# Altium project ELC0102 - Scoreboard.PrjPcb (part 2 of 2)

## Sheet ELC0102 - ScoreBoard - TopLevel.SchDoc: ELC102 - NEOS Scoreboard
size C; PageSetup: Record=PageOptions|CenterHorizontal=True|CenterVertical=True|PrintScale=0.33|XCorrection=1.00|YCorrection=1.00|PrintKind=0|BorderSize=5000000|LeftOffset=0|BottomOffset=0|Orientation=2|PaperLength=1000|PaperWidth=1000|Scale=100|PaperSource=15|PrintQuality=1200|MediaType=1|DitherType=10|PaperKind=11x17|PrintScaleMode=1
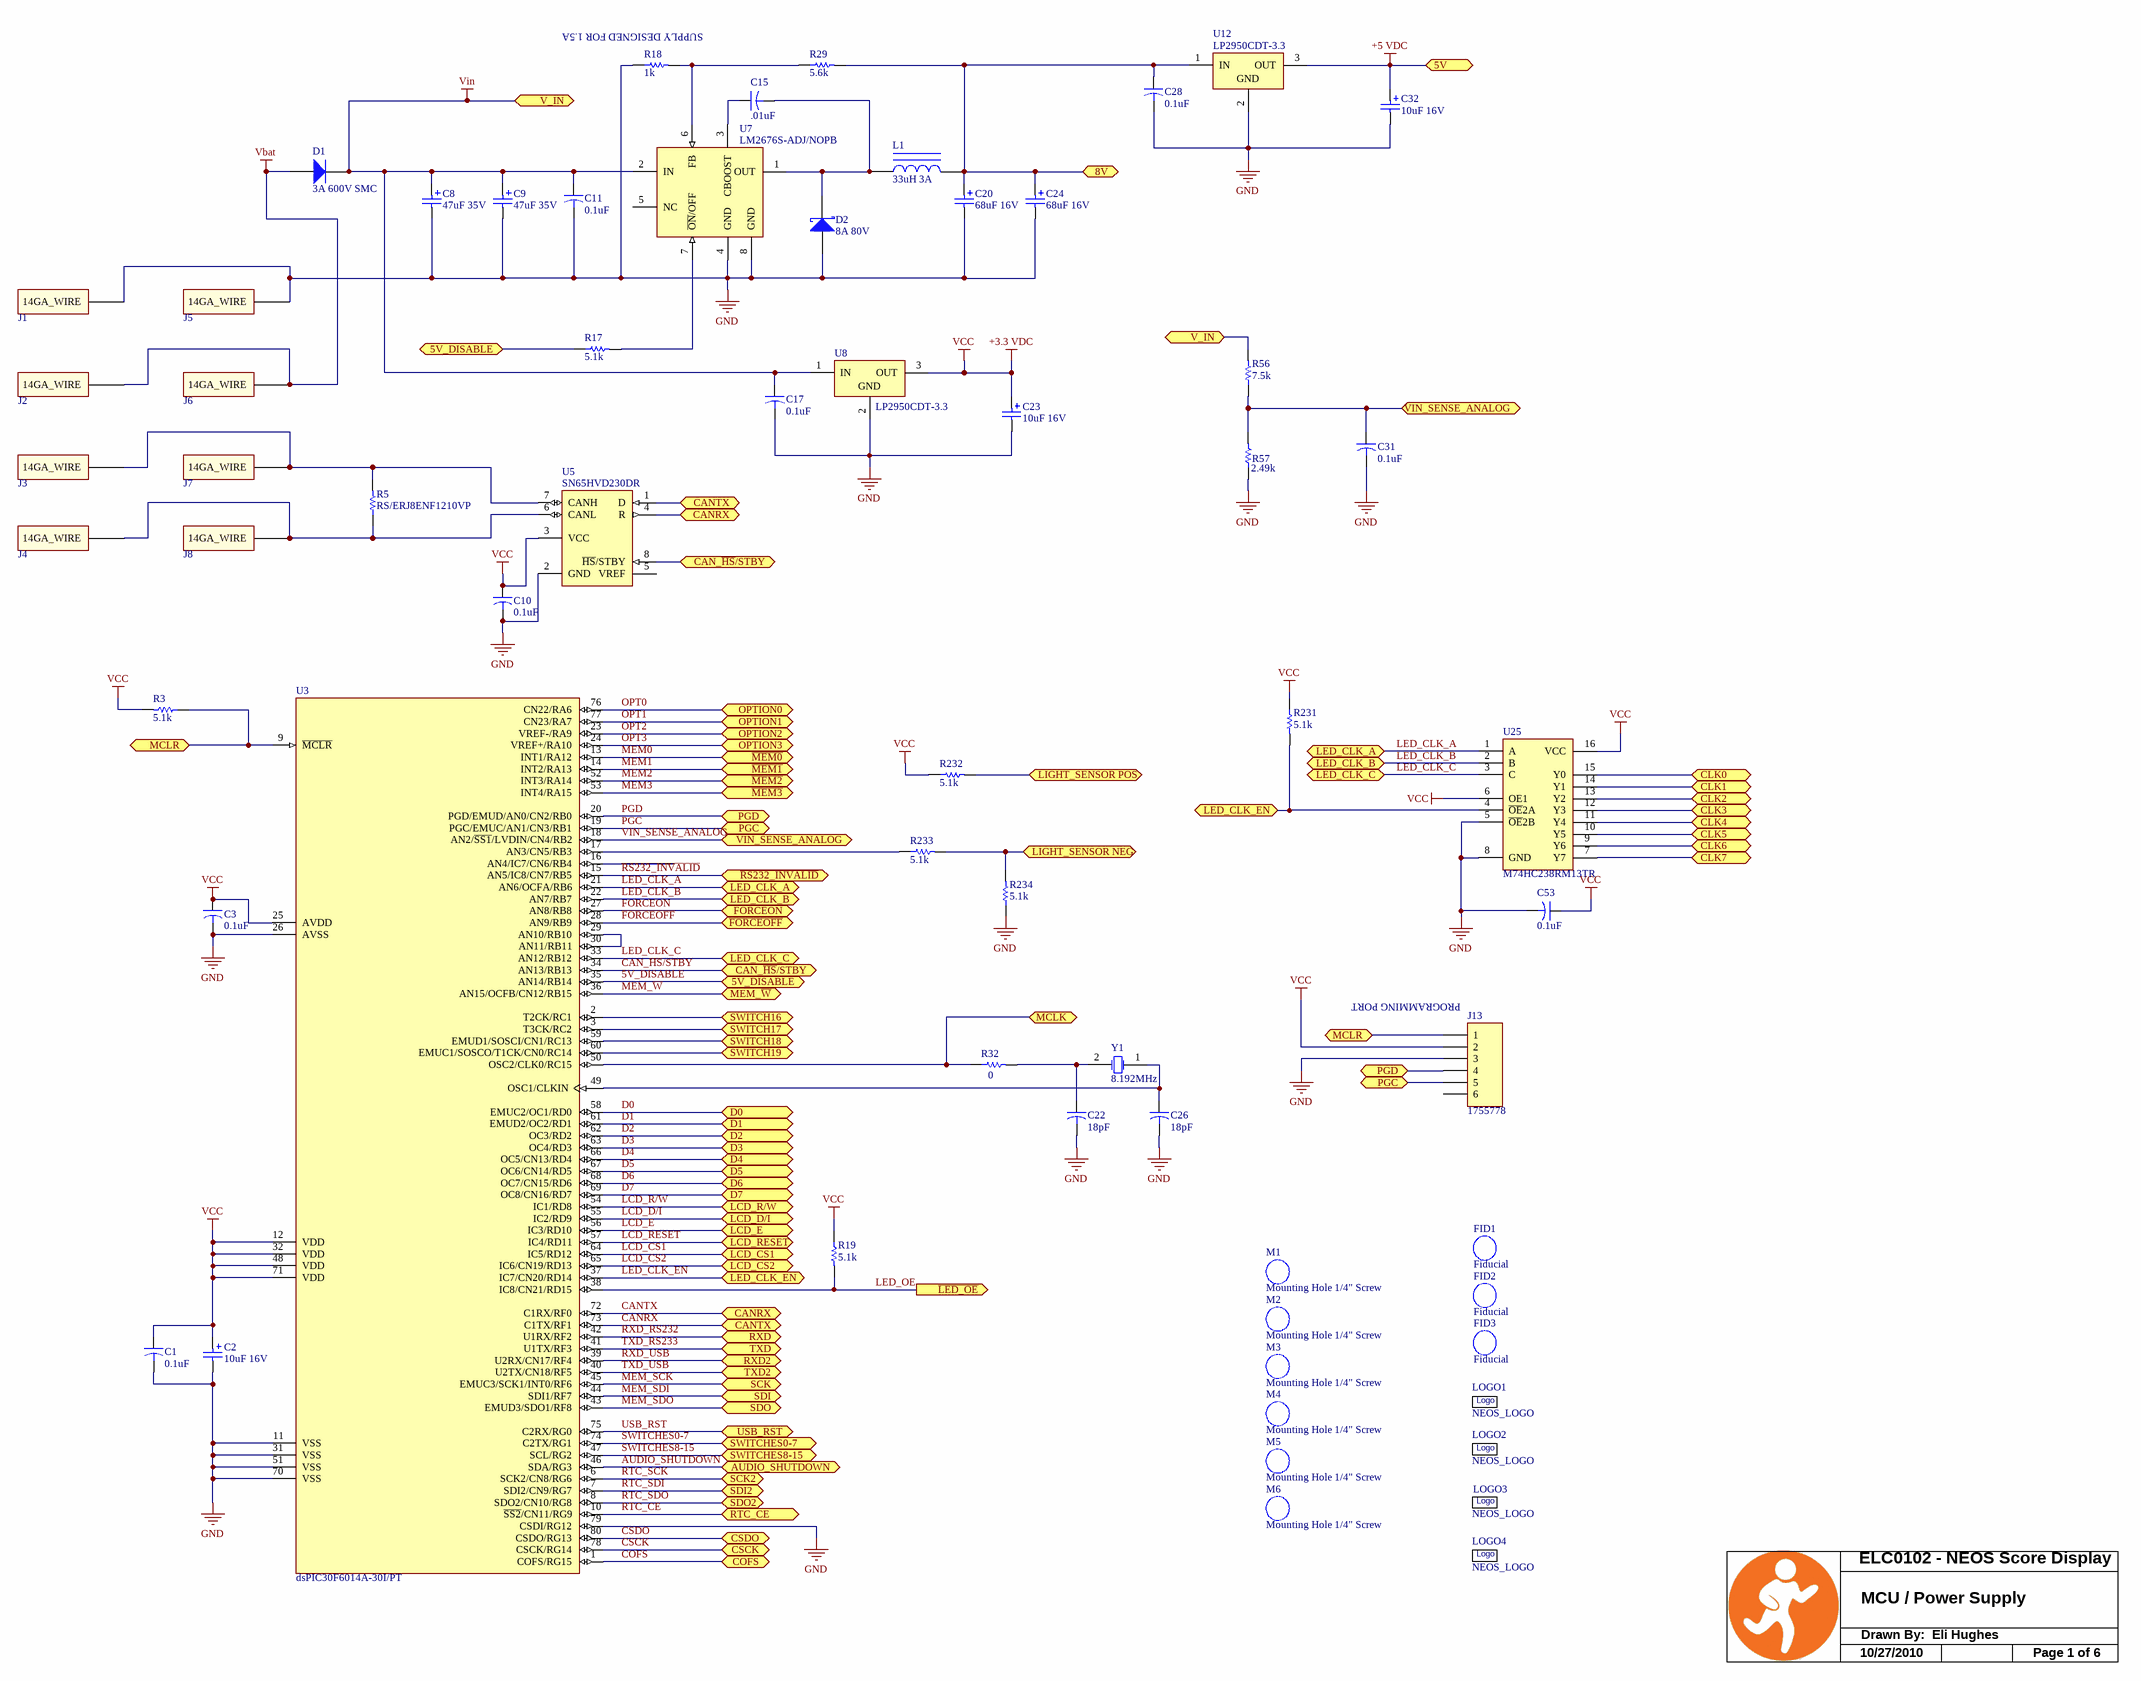
[diagram p8: ELC0102 - ScoreBoard - TopLevel.SchDoc]

### Parts
C1  0.1uF  [C0805]
C2  10uF 16V  [C4X5.8]
C3  0.1uF  [C0805]
C8  47uF 35V  [C EIA7343-43 (X)]
C9  47uF 35V  [C EIA7343-43 (X)]
C10  0.1uF  [C0805]
C11  0.1uF  [C0805]
C15  .01uF  [C0805]
C17  0.1uF  [C0805]
C20  68uF 16V  [C7343]
C22  18pF  [C0805]
C23  10uF 16V  [C4X5.8]
C24  68uF 16V  [C7343]
C26  18pF  [C0805]
C28  0.1uF  [C0805]
C31  0.1uF  [C0805]
C32  10uF 16V  [C4X5.8]
C53  0.1uF  [C0805]
D1  3A 600V SMC  [DIODE_SMC]
D2  8A 80V  [D2PAK]
FID1  Fiducial  [Fiducial]  (no BOM)
FID2  Fiducial  [Fiducial]  (no BOM)
FID3  Fiducial  [Fiducial]  (no BOM)
J1  ~14GA_WIRE  [WIRE_14GA]  (value not drawn)  (no BOM)
J2  ~14GA_WIRE  [WIRE_14GA]  (value not drawn)  (no BOM)
J3  ~14GA_WIRE  [WIRE_14GA]  (value not drawn)  (no BOM)
J4  ~14GA_WIRE  [WIRE_14GA]  (value not drawn)  (no BOM)
J5  ~14GA_WIRE  [WIRE_14GA]  (value not drawn)  (no BOM)
J6  ~14GA_WIRE  [WIRE_14GA]  (value not drawn)  (no BOM)
J7  ~14GA_WIRE  [WIRE_14GA]  (value not drawn)  (no BOM)
J8  ~14GA_WIRE  [WIRE_14GA]  (value not drawn)  (no BOM)
J13  1755778  [JCPM5086VE0Z]
L1  33uH 3A  [IND/DO5022]
LOGO1  NEOS_LOGO  [FULL_LOGO]  (no BOM)
LOGO2  NEOS_LOGO  [NEOS_LOGO_0]  (no BOM)
LOGO3  NEOS_LOGO  [FULL_LOGO_1]  (no BOM)
LOGO4  NEOS_LOGO  [NEOS_LOGO_1]  (no BOM)
M1  Mounting Hole 1/4" Screw  [MHole250]  (no BOM)
M2  Mounting Hole 1/4" Screw  [MHole250]  (no BOM)
M3  Mounting Hole 1/4" Screw  [MHole250]  (no BOM)
M4  Mounting Hole 1/4" Screw  [MHole250]  (no BOM)
M5  Mounting Hole 1/4" Screw  [MHole250]  (no BOM)
M6  Mounting Hole 1/4" Screw  [MHole250]  (no BOM)
R3  5.1k  [R0805]
R5  RS/ERJ8ENF1210VP  [R1206]  (no BOM)
R17  5.1k  [R0805]
R18  1k  [R0805]
R19  5.1k  [R0805]
R29  5.6k  [R0805]
R32  0  [R0805]
R56  7.5k  [R0805]
R57  2.49k  [R0805]
R231  5.1k  [R0805]
R232  5.1k  [R0805]
R233  5.1k  [R0805]
R234  5.1k  [R0805]
U3  dsPIC30F6014A-30I/PT  [TQFP-80]
U5  SN65HVD230DR  [SOIC 8]
U7  LM2676S-ADJ/NOPB  [TO263\7]
U8  LP2950CDT-3.3  [D-PAK / TO-252AA]
U12  LP2950CDT-3.3  [D-PAK / TO-252AA]
U25  M74HC238RM13TR  [SOIC 16]
Y1  8.192MHz  [XTSL\CSM-7]

### Ports
5V, 5V_DISABLE, 8V, AUDIO_SHUTDOWN, CAN_~{HS}/STBY, CANRX, CANTX, CLK0, CLK1, CLK2, CLK3, CLK4, CLK5, CLK6, CLK7, COFS, CSCK, CSDO, D0, D1, D2, D3, D4, D5, D6, D7, FORCEON, LCD_CS1, LCD_CS2, LCD_D/I, LCD_E, LCD_R/W, LCD_RESET, LED_CLK_A, LED_CLK_B, LED_CLK_C, LED_CLK_EN, LIGHT_SENSOR NEG, LIGHT_SENSOR POS, MCLK, MCLR, MEM_~{W}, OPTION0, OPTION1, OPTION2, OPTION3, PGC, PGD, RTC_CE, RXD, RXD2, SCK, SCK2, SDI, SDI2, SDO, SDO2, SWITCH16, SWITCH17, SWITCH18, SWITCH19, SWITCHES0-7, SWITCHES8-15, TXD, TXD2, USB_RST, V_IN, VIN_SENSE_ANALOG, ~{FORCEOFF}, ~{LED_OE} (out), ~{MEM0}, ~{MEM1}, ~{MEM2}, ~{MEM3}, ~{RS232_INVALID}

### Nets
+3.3 VDC: C1.1 C2.1 C3.1 C10.1 C23.1 C53.1 J13.2 R3.2 R19.1 R231.1 R232.1 U3.12(VDD) U3.25(AVDD) U3.32(VDD) U3.48(VDD) U3.71(VDD) U5.3(VCC) U8.3(OUT) U25.6(OE1) U25.16(VCC)  [also labelled VCC]
+5 VDC: C32.1 U12.3(OUT) ; port 5V
GND: C1.2 C2.2 C3.2 C8.2 C9.2 C10.2 C11.2 C17.2 C20.2 C22.2 C23.2 C24.2 C26.2 C28.2 C31.2 C32.2 C53.2 D2.3(A) J1.1(14GA_WIRE) J5.1(14GA_WIRE) J13.3 R18.1 R57.1 R234.1 U3.11(VSS) U3.26(AVSS) U3.31(VSS) U3.51(VSS) U3.70(VSS) U3.79(CSDI/RG12) U5.2(GND) U7.4(GND) U7.8(GND) U8.2(GND) U12.2(GND) U25.5(~{OE}2B) U25.8(GND)
Vbat: D1.A J2.1(14GA_WIRE) J6.1(14GA_WIRE)
Vin: C8.1 C9.1 C11.1 C17.1 D1.K R56.2 U7.2(IN) U8.1(IN) ; port V_IN
5V_DISABLE: R17.1 U3.35(AN14/RB14) ; port 5V_DISABLE
8V: C20.1 C24.1 C28.1 L1.2 R29.2 U12.1(IN) ; port 8V
AUDIO_SHUTDOWN: U3.46(SDA/RG3) ; port AUDIO_SHUTDOWN
CAN_~{HS}/STBY: U3.34(AN13/RB13) U5.8(~{HS}/STBY) ; port CAN_~{HS}/STBY
CANRX: U3.73(C1TX/RF1) U5.1(D) ; port CANTX
CANTX: U3.72(C1RX/RF0) U5.4(R) ; port CANRX
CLK0: U25.15(Y0) ; port CLK0
CLK1: U25.14(Y1) ; port CLK1
CLK2: U25.13(Y2) ; port CLK2
CLK3: U25.12(Y3) ; port CLK3
CLK4: U25.11(Y4) ; port CLK4
CLK5: U25.10(Y5) ; port CLK5
CLK6: U25.9(Y6) ; port CLK6
CLK7: U25.7(Y7) ; port CLK7
COFS: U3.1(COFS/RG15) ; port COFS
CSCK: U3.78(CSCK/RG14) ; port CSCK
CSDO: U3.80(CSDO/RG13) ; port CSDO
D0: U3.58(EMUC2/OC1/RD0) ; port D0
D1: U3.61(EMUD2/OC2/RD1) ; port D1
D2: U3.62(OC3/RD2) ; port D2
D3: U3.63(OC4/RD3) ; port D3
D4: U3.66(OC5/CN13/RD4) ; port D4
D5: U3.67(OC6/CN14/RD5) ; port D5
D6: U3.68(OC7/CN15/RD6) ; port D6
D7: U3.69(OC8/CN16/RD7) ; port D7
~{FORCEOFF}: U3.28(AN9/RB9) ; port ~{FORCEOFF}
FORCEON: U3.27(AN8/RB8) ; port FORCEON
LCD_CS1: U3.64(IC5/RD12) ; port LCD_CS1
LCD_CS2: U3.65(IC6/CN19/RD13) ; port LCD_CS2
LCD_D/I: U3.55(IC2/RD9) ; port LCD_D/I
LCD_E: U3.56(IC3/RD10) ; port LCD_E
LCD_R/W: U3.54(IC1/RD8) ; port LCD_R/W
LCD_RESET: U3.57(IC4/RD11) ; port LCD_RESET
LED_CLK_A: U3.21(AN6/OCFA/RB6) U25.1(A) ; port LED_CLK_A
LED_CLK_B: U3.22(AN7/RB7) U25.2(B) ; port LED_CLK_B
LED_CLK_C: U3.33(AN12/RB12) U25.3(C) ; port LED_CLK_C
LED_CLK_EN: R231.2 U3.37(IC7/CN20/RD14) U25.4(~{OE}2A) ; port LED_CLK_EN
LED_OE: R19.2 U3.38(IC8/CN21/RD15) ; port ~{LED_OE}
LIGHT_SENSOR NEG: R233.2 R234.2 ; port LIGHT_SENSOR NEG
LIGHT_SENSOR POS: R232.2 ; port LIGHT_SENSOR POS
MCLK: R32.1 U3.50(OSC2/CLK0/RC15) ; port MCLK
MCLR: J13.1 R3.1 U3.9(~{MCLR}) ; port MCLR
MEM0: U3.13(INT1/RA12) ; port ~{MEM0}
MEM1: U3.14(INT2/RA13) ; port ~{MEM1}
MEM2: U3.52(INT3/RA14) ; port ~{MEM2}
MEM3: U3.53(INT4/RA15) ; port ~{MEM3}
MEM_SCK: U3.45(EMUC3/SCK1/INT0/RF6) ; port SCK
MEM_SDI: U3.44(SDI1/RF7) ; port SDI
MEM_SDO: U3.43(EMUD3/SDO1/RF8) ; port SDO
MEM_~{W}: U3.36(AN15/OCFB/CN12/RB15) ; port MEM_~{W}
OPT0: U3.76(CN22/RA6) ; port OPTION0
OPT1: U3.77(CN23/RA7) ; port OPTION1
OPT2: U3.23(VREF-/RA9) ; port OPTION2
OPT3: U3.24(VREF+/RA10) ; port OPTION3
PGC: J13.5 U3.19(PGC/EMUC/AN1/CN3/RB1) ; port PGC
PGD: J13.4 U3.20(PGD/EMUD/AN0/CN2/RB0) ; port PGD
~{RS232_INVALID}: U3.15(AN5/IC8/CN7/RB5) ; port ~{RS232_INVALID}
RTC_CE: U3.10(~{SS2}/CN11/RG9) ; port RTC_CE
RTC_SCK: U3.6(SCK2/CN8/RG6) ; port SCK2
RTC_SDI: U3.7(SDI2/CN9/RG7) ; port SDI2
RTC_SDO: U3.8(SDO2/CN10/RG8) ; port SDO2
RXD_RS232: U3.42(U1RX/RF2) ; port RXD
RXD_USB: U3.39(U2RX/CN17/RF4) ; port RXD2
SWITCH16: U3.2(T2CK/RC1) ; port SWITCH16
SWITCH17: U3.3(T3CK/RC2) ; port SWITCH17
SWITCH18: U3.59(EMUD1/SOSCI/CN1/RC13) ; port SWITCH18
SWITCH19: U3.60(EMUC1/SOSCO/T1CK/CN0/RC14) ; port SWITCH19
SWITCHES0-7: U3.74(C2TX/RG1) ; port SWITCHES0-7
SWITCHES8-15: U3.47(SCL/RG2) ; port SWITCHES8-15
TXD_RS233: U3.41(U1TX/RF3) ; port TXD
TXD_USB: U3.40(U2TX/CN18/RF5) ; port TXD2
USB_RST: U3.75(C2RX/RG0) ; port USB_RST
VIN_SENSE_ANALOG: C31.1 R56.1 R57.2 U3.18(AN2/~{SS1}/LVDIN/CN4/RB2) ; port VIN_SENSE_ANALOG
NetC15_1: C15.1 U7.3(CBOOST)
NetC15_2: C15.2 D2.2(K) L1.1 U7.1(OUT)
NetC22_1: C22.1 R32.2 Y1.2(OSC2)
NetC26_1: C26.1 U3.49(OSC1/CLKIN) Y1.1(OSC1)
NetJ3_1: J3.1(14GA_WIRE) J7.1(14GA_WIRE) R5.2 U5.7(CANH)
NetJ4_1: J4.1(14GA_WIRE) J8.1(14GA_WIRE) R5.1 U5.6(CANL)
NetR17_2: R17.2 U7.7(~{ON}/OFF)
NetR18_2: R18.2 R29.1 U7.6(FB)
NetR233_1: R233.1 U3.17(AN3/CN5/RB3)
NetU3_29: U3.29(AN10/RB10) U3.30(AN11/RB11)

Not connected (* = marked no-connect by the designer): D2 1(NC); J13 6; U3 16(AN4/IC7/CN6/RB4); U5 5(VREF); U7 5(NC)

### Notes on the sheet
- (near R29) SUPPLY DESIGNED FOR 1.5A
- (near J13) PROGRAMMING PORT
- ELC0102 - NEOS Score Display
- MCU / Power Supply
- 10/27/2010
- Drawn By:  Eli Hughes
- Page 1 of 6
- (in symbol NEOS_LOGO) Logo

### Library data of the parts
C1 C3 C10 C11 C17 C28 C31 C53 = CS/C0805C104K5RACK: CAP .10UF 50V CERAMIC X7R 0805; Manufacturer: Kemet; Manufacturer Part Number: C0805C104K5RACTU; Source Part Number: 399-1170-2-ND; Capacitance: 0.1µF; Tolerance: ±10%; ROHS Certificate: Lead free / RoHS compliant; Source: Digikey; Value: 0.1uF; Supplier 1: Digi-Key; RoHS: RoHS Compliant; Category: Capacitors; Stock 1: 10120790; Pricing 1: 10=0.105, 100=0.0378, 250=0.02732, 500=0.02016, 1000=0.01365 (USD); Voltage - Rated: 50V; Temperature Coefficient: X7R; Mounting Type: Surface Mount, MLCC; Operating Temperature: -55°C ~ 125°C; Features: -; Applications: General Purpose; Ratings: -; Package / Case: 0805 (2012 Metric); Size / Dimension: 0.079" L x 0.049" W (2.00mm x 1.25mm); Lead Spacing: -; Thickness: 0.90mm; Packaging: Cut Tape (CT); Lead Style: -; ComponentLink1URL: http://www.kemet.com/datasheets&C0805C104K5RACTU; ComponentLink1Description: http://www.kemet.com/datasheets&C0805C104K5RACTU; Supplier Part Number 1: 399-1170-1-ND
C2 C23 C32 = CS/EEVFK1C100RP: Panasonic 10uF 16V SMT; Manufacturer: Panasonic - ECG; Manufacturer Part Number: EEE-FK1C100R; Source Part Number: PCE3782TR-ND; Value: EEE-FK1C100R; Description: CAP ELECT 10UF 16V FK SMD; Capacitance: 10µF; Tolerance: ±20%; Lifetime @ Temp.: 2000 Hrs @ 105°C; Ripple Current: 90mA; Impedance: 1.35 Ohm; Surface Mount Land Size: 0.169" L x 0.169" W (4.30mm x 4.30mm); ROHS Certificate: Lead free / RoHS compliant; Source: Digikey; Supplier 1: Digi-Key; RoHS: RoHS Compliant; Category: Capacitors; Stock 1: 412703; Pricing 1: 1=0.54, 50=0.309, 100=0.2575, 250=0.19312, 500=0.1648, 1000=0.12875 (USD); Voltage Rating: 16V; Operating Temperature: -55°C ~ 105°C; Features: General Purpose; ESR (Equivalent Series Resistance): -; Mounting Type: Surface Mount; Package / Case: Radial, Can - SMD; Size / Dimension: 0.157" Dia (4.00mm); Height: 0.228" (5.80mm); Lead Spacing: -; Packaging: Cut Tape (CT); ComponentLink1URL: http://industrial.panasonic.com/www-cgi/jvcr13pz.cgi?E+PZ+3+ABA0120+EEEFK1C100R+7+WW; ComponentLink1Description: http://industrial.panasonic.com/www-cgi/jvcr13pz.cgi?E+PZ+3+ABA0120+EEEFK1C100R+7+WW; Supplier Part Number 1: PCE3782CT-ND
C8 C9 = C#S/T491X476K035ATK: Kemet Tantalum 47uF 35V EIA7343-43; Source Part Number: 399-3821-2-ND; Manufacturer: Kemet; Manufacturer Part Number: T491X476K035AT; ROHS Certificate: Lead free / RoHS compliant; Source: Digikey; Value: T491X476K035AT; Supplier 1: Digi-Key; Supplier Part Number 1: 399-3821-1-ND
C15 = CS/C0805C103K5RAC: CAP 10000PF 50V CERAMIC X7R 0805; Manufacturer: Kemet; Manufacturer Part Number: C0805C103K5RACTU; Source Part Number: 399-1158-2-ND; Tolerance: ±10%; ROHS Certificate: Lead free / RoHS compliant; Source: Digikey; Value: .01uF; Supplier 1: Digi-Key; RoHS: RoHS Compliant; Category: Capacitors; Stock 1: 1770160; Pricing 1: 10=0.07, 100=0.0252, 250=0.0182, 500=0.01344, 1000=0.0091 (USD); Capacitance: 10000pF; Voltage - Rated: 50V; Temperature Coefficient: X7R; Mounting Type: Surface Mount, MLCC; Operating Temperature: -55°C ~ 125°C; Features: -; Applications: General Purpose; Ratings: -; Package / Case: 0805 (2012 Metric); Size / Dimension: 0.079" L x 0.049" W (2.00mm x 1.25mm); Lead Spacing: -; Thickness: 0.78mm; Packaging: Cut Tape (CT); Lead Style: -; ComponentLink1URL: http://www.kemet.com/datasheets&C0805C103K5RACTU; ComponentLink1Description: http://www.kemet.com/datasheets&C0805C103K5RACTU; Supplier Part Number 1: 399-1158-1-ND
C20 C24 = CS/T495D686K016ASE1K: CAPACITOR TANT 68UF 16V 10% SMD; Manufacturer: Kemet; Manufacturer Part Number: T495D686K016ATE150; Source Part Number: 399-3889-2-ND; Manufacturer Size Code: D; Value: T495D686K016ATE150; Capacitance: 68µF; ESR (Equivalent Series Resistance): 150.0 mOhm; Type: Molded; ROHS Certificate: Lead free / RoHS compliant; Source: Digikey; Supplier 1: Digi-Key; RoHS: RoHS Compliant; Category: Capacitors; Stock 1: 568; Pricing 1: 1=1.35, 10=1.128, 25=0.972, 100=0.828, 250=0.72 (USD); Voltage - Rated: 16V; Tolerance: ±10%; Operating Temperature: -55°C ~ 125°C; Mounting Type: Surface Mount; Package / Case: 2917 (7343 Metric); Size / Dimension: 0.287" L x 0.169" W (7.30mm x 4.30mm); Height: 0.110" (2.80mm); Lead Spacing: -; Features: General Purpose; Packaging: Cut Tape (CT); Lifetime @ Temp.: -; ComponentLink1URL: http://www.kemet.com/datasheets&T495D686K016ATE150; ComponentLink1Description: http://www.kemet.com/datasheets&T495D686K016ATE150; Supplier Part Number 1: 399-3889-1-ND
C22 C26 = CS/C0805C180J5GACTUK: CAP CERAMIC 18PF 50V NP0 0805; Manufacturer: Kemet; Source Part Number: 399-1112-2-ND; Tolerance: ±5%; Temperature Coefficient: C0G, NP0; Manufacturer Part Number: C0805C180J5GACTU; ROHS Certificate: Lead free / RoHS compliant; Source: Digikey; Value: C0805C180J5GACTU; Supplier 1: Digi-Key; RoHS: RoHS Compliant; Category: Capacitors; Stock 1: 156000; Pricing 1: 10=0.17, 100=0.0612, 250=0.0442, 500=0.03264, 1000=0.0221 (USD); Capacitance: 18pF; Voltage - Rated: 50V; Mounting Type: Surface Mount, MLCC; Operating Temperature: -55°C ~ 125°C; Features: -; Applications: General Purpose; Ratings: -; Package / Case: 0805 (2012 Metric); Size / Dimension: 0.079" L x 0.049" W (2.00mm x 1.25mm); Lead Spacing: -; Thickness: 0.78mm; Packaging: Cut Tape (CT); Lead Style: -; ComponentLink1URL: http://www.kemet.com/datasheets&C0805C180J5GACTU; ComponentLink1Description: http://www.kemet.com/datasheets&C0805C180J5GACTU; Supplier Part Number 1: 399-1112-1-ND
D1 = D#S/MURS360T3GM: Diode 3A 600V SMC; Manufacturer: ON Semiconductor; Source Part Number: MURS360T3GOSTR-ND; Description: DIODE ULTRA FAST 3A 600V SMC; Voltage - Forward (Vf) (Max) @ If: 1.28V @ 4A; Current - Average Rectified (Io): 4A; Current - Reverse Leakage @ Vr: 10µA @ 600V; Diode Type: Standard; Speed: Fast Recovery =< 500ns, > 200mA (Io); Reverse Recovery Time (trr): 75ns; Manufacturer Part Number: MURS360T3G; ROHS Certificate: Lead free / RoHS compliant; Source: Digikey; Value: MURS360T3G; Supplier 1: Digi-Key; RoHS: RoHS Compliant; Category: Discrete Semiconductor Products; Stock 1: 0; Pricing 1: 1=0.73, 10=0.628, 100=0.4961, 250=0.42992, 500=0.36378, 1000=0.28936 (USD); Voltage - DC Reverse (Vr) (Max): 600V; Capacitance @ Vr, F: -; Mounting Type: Surface Mount; Package / Case: DO-214AB, SMC; Packaging: Cut Tape (CT); Supplier Device Package: SMCJ (DO-214AB); ComponentLink1URL: http://www.onsemi.com/pub_link/Collateral/MURS320T3-D.PDF; ComponentLink1Description: http://www.onsemi.com/pub_link/Collateral/MURS320T3-D.PDF; Supplier Part Number 1: MURS360T3GOSCT-ND
D2 = DS/8TQ080S0Z: IR Schottky Diode 8A 80V D2PAK; Manufacturer: Vishay IR; Manufacturer Part Number: 8TQ080SPBF; Source Part Number: 8TQ080SPBF-ND; Value: 8TQ080SPBF; Description: VISHAY FORMERLY I.R. - 8TQ080SPBF - SCHOTTKY RECTIFIER, 8A, 80V, D2-PAK; Repetitive Reverse Voltage Max, Vrrm: 80; Forward Current (AV): 8; Forward Voltage Max, VF: 720; Forward Surge Current Max, Ifsm: 850; ROHS Certificate: Lead free / RoHS compliant; Source: Digikey; Supplier 1: Digi-Key; Supplier 2: Newark; RoHS: YES; Category: Semiconductors - Discretes; Stock 2: 834; Pricing 2: 1=3.34, 10=3.2, 100=3.08, 1000=2.53, 5000=2.27, 10000=2.1 (USD); Diode Type: Schottky; ComponentLink1URL: http://www.vishay.com/docs/94266/94266.pdf; ComponentLink1Description: http://www.vishay.com/docs/94266/94266.pdf; Supplier Part Number 1: 8TQ080SPBF-ND; Supplier Part Number 2: 63J8109
J13 = JCPM5086VE0Z: CONN HEADER VERT 6POS 5.08MM; Manufacturer: Phoenix Contact; Positions Per Level: 6; Pitch: 0.200" (5.08mm); Number of Levels: 1; Header Orientation: Vertical; Current: 10A; Voltage: 300V; Manufacturer Part Number: 1755778; Supplier 1: Digi-Key; RoHS: RoHS Compliant; Category: Connectors, Interconnects; Stock 1: 1381; Pricing 1: 1=1.41, 10=1.37, 50=1.28, 100=1.1776, 250=1.088, 500=1.0368, 1000=0.9728 (USD); Terminal Block Type: Header, Male Pins, Shrouded (4 Side); Plug Wire Entry: -; Termination: Solder; Wire Gauge: -; Mounting Type: Through Hole; Features: -; Color: Green; Packaging: Bulk; ComponentLink1URL: http://media.digikey.com/pdf/Data%20Sheets/Phoenix%20Contact%20PDFs/1755778.pdf; Supplier Part Number 1: 277-1154-ND; ComponentLink1Description: http://media.digikey.com/pdf/Data%20Sheets/Phoenix%20Contact%20PDFs/1755778.pdf; Value: 1755778
L1 = NS/DO5022P333Z: Magnetic-Core Inductor; Manufacturer: Coilcraft; Manufacturer Part Number: DO5022P-333MLD; Supplier 1: Coilcraft; Supplier Part Number 1: DO5022P-333MLD; Value: 33uH 3A
M1-M6 = MountingHole_1/4
R3 R17 R19 R231-R234 = ERJ-6ENF5101V: RES 5.10K OHM 1/8W 1% 0805 SMD; Manufacturer: Panasonic - ECG; Power (Watts): 0.125W, 1/8W; Temperature Coefficient: ±100ppm/°C; ComponentLink1Description: http://industrial.panasonic.com/www-cgi/jvcr13pz.cgi?E+PZ+3+AOA0002+ERJ6ENF5101V+7+WW; ComponentLink1URL: http://industrial.panasonic.com/www-cgi/jvcr13pz.cgi?E+PZ+3+AOA0002+ERJ6ENF5101V+7+WW; Value: 5.1k; Supplier 1: Digi-Key; Manufacturer Part Number: ERJ-6ENF5101V; RoHS: RoHS Compliant; Category: Resistors; Stock 1: 32293; Pricing 1: 1=0.07, 50=0.0276, 100=0.021, 250=0.0156, 500=0.01152, 1000=0.00768 (USD); Resistance In Ohms: 5.10K; Composition: Thick Film; Features: -; Tolerance: ±1%; Case: 0805 (2012 metric); Size / Dimension: 0.079" L x 0.049" W (2.00mm x 1.25mm); Height: 0.024" (0.60mm); Lead Style: Surface Mount (SMD - SMT); Packaging: Digi-Reel®; Supplier Part Number 1: P5.10KCDKR-ND
R5 = RS/ERJ8ENF: Panasonic resistor MF 1% SMT; Value: 121; Published: 17-Dec-2003; LatestRevisionDate: 19-Mar-2004; LatestRevisionNote: Silkscreen size reduced.; PackageDocument: Mar-2003; PackageReference: 6-0805; Publisher: Altium Limited; ComponentLink1Description: Manufacturer Link; ComponentLink1URL: http://www.panasonic.com/flash.html; Code_IPC: 2012 [0805]
R18 = ERJ-6ENF1001V: RES 1.00K OHM 1/8W 1% 0805 SMD; Manufacturer: Panasonic - ECG; Source Part Number: P1.00KCCT-ND; Value: 1k 1%; Power (Watts): 0.125W, 1/8W; Temperature Coefficient: ±100ppm/°C; Manufacturer Part Number: ERJ-6ENF1001V; Source: Digikey; ROHS Certificate: *; Supplier 1: Digi-Key; RoHS: RoHS Compliant; Category: Resistors; Stock 1: 988564; Pricing 1: 1=0.07, 50=0.0276, 100=0.021, 250=0.0156, 500=0.01152, 1000=0.00768 (USD); Resistance In Ohms: 1.00K; Composition: Thick Film; Features: -; Tolerance: ±1%; Case: 0805 (2012 metric); Size / Dimension: 0.079" L x 0.049" W (2.00mm x 1.25mm); Height: 0.024" (0.60mm); Lead Style: Surface Mount (SMD - SMT); Packaging: Cut Tape (CT); ComponentLink1URL: http://industrial.panasonic.com/www-cgi/jvcr13pz.cgi?E+PZ+3+AOA0002+ERJ6ENF1001V+7+WW; ComponentLink1Description: http://industrial.panasonic.com/www-cgi/jvcr13pz.cgi?E+PZ+3+AOA0002+ERJ6ENF1001V+7+WW; Supplier Part Number 1: P1.00KCCT-ND
R29 = ERJ-6ENF5601V: RES 5.60K OHM 1/8W 1% 0805 SMD; Manufacturer: Panasonic - ECG; Power (Watts): 0.125W, 1/8W; Temperature Coefficient: ±100ppm/°C; ComponentLink1Description: http://industrial.panasonic.com/www-cgi/jvcr13pz.cgi?E+PZ+3+AOA0002+ERJ6ENF5601V+7+WW; ComponentLink1URL: http://industrial.panasonic.com/www-cgi/jvcr13pz.cgi?E+PZ+3+AOA0002+ERJ6ENF5601V+7+WW; Value: 5.6k; Supplier 1: Digi-Key; Manufacturer Part Number: ERJ-6ENF5601V; RoHS: RoHS Compliant; Category: Resistors; Stock 1: 0; Resistance In Ohms: 5.60K; Composition: Thick Film; Features: -; Tolerance: ±1%; Case: 0805 (2012 metric); Size / Dimension: 0.079" L x 0.049" W (2.00mm x 1.25mm); Height: 0.024" (0.60mm); Lead Style: Surface Mount (SMD - SMT); Packaging: Cut Tape (CT); Supplier Part Number 1: P5.60KCCT-ND
R32 = ERJ-6GEY0R00V: RES 0.0 OHM 1/8W 5% 0805 SMD; Source Part Number: P0.0ACT-ND; Manufacturer: Panasonic - ECG; Description: RES 0.0 OHM 1/8W 0805 SMD; Resistance In Ohms: 0.0; Power (Watts): 0.125W, 1/8W; Temperature Coefficient: -100/ +600ppm/°C; Tolerance: Jumper; Value: RES 0.0 OHM 1/8W 5% 0805 SMD; Source: Digikey; Manufacturer Part Number: ERJ-6GEY0R00V; ROHS Certificate: *; Supplier 1: Digi-Key; RoHS: RoHS Compliant; Category: Resistors; Stock 1: 2923930; Pricing 1: 1=0.04, 50=0.0162, 100=0.0123, 250=0.00912, 500=0.00672, 1000=0.00448 (USD); Composition: Thick Film; Features: -; Case: 0805 (2012 metric); Size / Dimension: 0.079" L x 0.049" W (2.00mm x 1.25mm); Height: 0.024" (0.60mm); Lead Style: Surface Mount (SMD - SMT); Packaging: Digi-Reel®; ComponentLink1URL: http://industrial.panasonic.com/www-cgi/jvcr13pz.cgi?E+PZ+3+AOA0001+ERJ6GEY0R00V+7+WW; ComponentLink1Description: http://industrial.panasonic.com/www-cgi/jvcr13pz.cgi?E+PZ+3+AOA0001+ERJ6GEY0R00V+7+WW; Supplier Part Number 1: P0.0ADKR-ND
R56 = ERJ-6ENF7501V: RES 7.50K OHM 1/8W 1% 0805 SMD; Manufacturer: Panasonic - ECG; Power (Watts): 0.125W, 1/8W; Temperature Coefficient: ±100ppm/°C; ComponentLink1Description: http://industrial.panasonic.com/www-cgi/jvcr13pz.cgi?E+PZ+3+AOA0002+ERJ6ENF7501V+7+WW; ComponentLink1URL: http://industrial.panasonic.com/www-cgi/jvcr13pz.cgi?E+PZ+3+AOA0002+ERJ6ENF7501V+7+WW; Value: 7.5k; Supplier 1: Digi-Key; Manufacturer Part Number: ERJ-6ENF7501V; RoHS: RoHS Compliant; Category: Resistors; Stock 1: 212114; Resistance In Ohms: 7.50K; Composition: Thick Film; Features: -; Tolerance: ±1%; Case: 0805 (2012 metric); Size / Dimension: 0.079" L x 0.049" W (2.00mm x 1.25mm); Height: 0.024" (0.60mm); Lead Style: Surface Mount (SMD - SMT); Packaging: Cut Tape (CT); Supplier Part Number 1: P7.50KCCT-ND
R57 = ERJ-6ENF2491V: RES 2.49K OHM 1/8W 1% 0805 SMD; Manufacturer: Panasonic - ECG; Power (Watts): 0.125W, 1/8W; Temperature Coefficient: ±100ppm/°C; ComponentLink1Description: http://industrial.panasonic.com/www-cgi/jvcr13pz.cgi?E+PZ+3+AOA0002+ERJ6ENF2491V+7+WW; ComponentLink1URL: http://industrial.panasonic.com/www-cgi/jvcr13pz.cgi?E+PZ+3+AOA0002+ERJ6ENF2491V+7+WW; Value: 2.49k; Supplier 1: Digi-Key; Manufacturer Part Number: ERJ-6ENF2491V; RoHS: RoHS Compliant; Category: Resistors; Stock 1: 343258; Resistance In Ohms: 2.49K; Composition: Thick Film; Features: -; Tolerance: ±1%; Case: 0805 (2012 metric); Size / Dimension: 0.079" L x 0.049" W (2.00mm x 1.25mm); Height: 0.024" (0.60mm); Lead Style: Surface Mount (SMD - SMT); Packaging: Cut Tape (CT); Supplier Part Number 1: P2.49KCCT-ND
U3 = I#S/DSPIC30F6014A30IPTZ: Microchip dsPIC30F6014A 80-TQFP; Manufacturer: Microchip Technology; Source Part Number: DSPIC30F6014A30IP-ND; Description: IC DSPIC MCU/DSP 144K 80TQFP; Core Processor: dsPIC; Core Size: 16-Bit; Speed: 30 MIPs; Connectivity: CAN, I²C, SPI, UART/USART; Peripherals: AC'97, Brown-out Detect/Reset, I²S, LVD, POR, PWM, WDT; Number of I /O: 68; Program Memory Size: 144KB (48K x 24); Program Memory Type: FLASH; EEPROM Size: 4K x 8; RAM Size: 8K x 8; Voltage - Supply (Vcc/Vdd): 2.5 V ~ 5.5 V; Data Converters: A/D 16x12b; Oscillator Type: Internal; Manufacturer Part Number: DSPIC30F6014A-30I/PT; ROHS Certificate: Lead free / RoHS compliant; Source: Digikey; Value: DSPIC30F6014A-30I/PT; Supplier 1: Digi-Key; RoHS: RoHS Compliant; Category: Integrated Circuits (ICs); Stock 1: 2428; Pricing 1: 1=12.76, 10=10.03, 25=9.11, 100=8.28 (USD); Operating Temperature: -40°C ~ 85°C; Package / Case: 80-TFQFP; Packaging: Tray; ComponentLink1URL: http://ww1.microchip.com/downloads/en/DeviceDoc/70143D.pdf; ComponentLink1Description: http://ww1.microchip.com/downloads/en/DeviceDoc/70143D.pdf; Supplier Part Number 1: DSPIC30F6014A30IP-ND
U5 = IS/SN65HVD230DRT: CAN Transceiver 3.3V w/standby; Manufacturer: Texas Instruments; Source Part Number: 296-11654-1-ND; Description: IC 3.3V CAN TXRX W/STNDBY 8-SOIC; Number of Drivers/Receivers: 1/1; Voltage - Supply: 3 V ~ 3.6 V; Manufacturer Part Number: SN65HVD230DR; ROHS Certificate: Lead free / RoHS compliant; Source: Digikey; Value: SN65HVD230DR; Supplier 1: Digi-Key; RoHS: RoHS Compliant; Category: Integrated Circuits (ICs); Stock 1: 14262; Pricing 1: 1=4.05, 25=3.3076, 100=2.97, 250=2.7, 500=2.3625, 1000=2.025 (USD); Type: Transceiver; Protocol: CAN; Mounting Type: Surface Mount; Package / Case: 8-SOIC (0.154", 3.90mm Width); Packaging: Cut Tape (CT); Supplier Device Package: *; ComponentLink1URL: http://focus.ti.com/lit/ds/symlink/sn65hvd230.pdf; ComponentLink1Description: http://focus.ti.com/lit/ds/symlink/sn65hvd230.pdf; Supplier Part Number 1: 296-11654-1-ND
U7 = IS/LM2676SADJN: Simple Switcher Power Converter 150 kHz 3A Step Down Voltage Regulator; Manufacturer: NATIONAL SEMICONDUCTOR; Description: NATIONAL SEMICONDUCTOR - LM2676S-ADJ/NOPB - IC, STEP-DOWN REGULATOR, TO-263-7; No. of Outputs: 1; Output Voltage: 37; Output Current: 3; No. of Pins: 7; Input Voltage Primary Max: 40; Manufacturer Part Number: LM2676S-ADJ/NOPB; Value: LM2676S-ADJ/NOPB; Supplier 1: Newark; RoHS: YES; Category: Semiconductors - ICs; Stock 1: 6123; Pricing 1: 1=4.69, 25=3.75, 100=3.19, 250=2.94, 500=2.82, 1000=2.78, 5000=2.72, 5000=2.66 (USD); ComponentLink1URL: http://www.national.com/ds/LM/LM2676.pdf; ComponentLink1Description: http://www.national.com/ds/LM/LM2676.pdf; Supplier Part Number 1: 41K4150; Operating Temperature Range: -40°C to +125; Output Current Max: 3; Output Voltage Max: 37
U8 U12 = IS/LP2950CDT33N: National Voltage reculator 3.3V DPAK; Manufacturer: National Semiconductor; Manufacturer Part Number: LP2950CDT-3.0; Source Part Number: LP2950CDT-3.0-ND; Value: LP2950CDT-3.0; Description: IC VREG MICROPOWER TO-252; Regulator Topology: Positive Fixed; Voltage - Output: 3V; Voltage - Input: Up to 30V; Voltage - Dropout (Typical): 0.38V @ 100mA; Number of Regulators: 1; Current - Output: 100mA; ROHS Certificate: Lead free / RoHS compliant; Source: Digikey; Supplier 1: Digi-Key; RoHS: RoHS Compliant; Category: Integrated Circuits (ICs); Stock 1: 0; Pricing 1: 750=0.664 (USD); Current - Limit (Min): -; Operating Temperature: -40°C ~ 125°C; Mounting Type: Surface Mount; Package / Case: TO-252-2, DPak (2 Leads + Tab), TO-252AA, SC-63; Packaging: Tube; Supplier Device Package: TO-252, (D-Pak); ComponentLink1URL: http://www.national.com/ds/LP/LP2950.pdf; ComponentLink1Description: http://www.national.com/ds/LP/LP2950.pdf; Supplier Part Number 1: LP2950CDT-3.0-ND
U25 = M74HC238RM13TR: 3-Line to 8-Line Decoder / Demultiplexer; Manufacturer: STMicroelectronics; Description: IC DECODER 3 TO 8 LINE 16-SOIC; Circuit: 1 x 3:8; Independent Circuits: 1; Current - Output High, Low: 5.2mA, 5.2mA; Voltage Supply Source: Single Supply; Voltage - Supply: 2 V ~ 6 V; Supplier 1: Digi-Key; Supplier Part Number 1: 497-1800-1-ND; Manufacturer Part Number: M74HC238RM13TR; RoHS: RoHS Compliant; Category: Integrated Circuits (ICs); Stock 1: 20548; Pricing 1: 1=0.67, 10=0.532, 100=0.3993, 250=0.34484, 500=0.29646, 1000=0.2299 (USD); Type: Decoder; Operating Temperature: -55°C ~ 125°C; Mounting Type: Surface Mount; Package / Case: 16-SOIC (0.154", 3.90mm Width); Packaging: Cut Tape (CT); Supplier Device Package: *; ComponentLink1URL: http://www.st.com/stonline/products/literature/ds/1926/m74hc238.pdf; ComponentLink1Description: http://www.st.com/stonline/products/literature/ds/1926/m74hc238.pdf
Y1 = ABLS-8.192MHZ-B2-T: CRYSTAL 8.192MHZ 18PF SMD; Manufacturer: Abracon Corporation; Frequency Stability: ±50ppm; Frequency Tolerance: ±20ppm; Operating Mode: Fundamental; Supplier 1: Digi-Key; Supplier Part Number 1: 535-9090-1-ND; Manufacturer Part Number: ABLS-8.192MHZ-B2-T; RoHS: RoHS Compliant; Category: Crystals and Oscillators; Stock 1: 9113; Pricing 1: 1=0.56, 10=0.488, 50=0.4276, 100=0.3375, 500=0.285 (USD); Type: -; Frequency: 8.192MHz; Load Capacitance: 18pF; Operating Temperature: -20°C ~ 70°C; Mounting Type: Surface Mount; Package / Case: HC49/US; Size / Dimension: 0.450" L x 0.190" W (11.40mm x 4.70mm); Height: 0.165" (4.20mm); Packaging: Cut Tape (CT); ComponentLink1URL: http://www.abracon.com/Resonators/abls.pdf; ComponentLink1Description: http://www.abracon.com/Resonators/abls.pdf; Value: 8.192MHz
LOGO1-LOGO4 = NEOS_LOGO: Manufacturer: *; Manufacturer Part Number: *; Source: *; Source Part Number: *; Value: *; ROHS Certificate: *

## Sheet ELC0102 - Switch Interface.SchDoc: ELC102 - NEOS Scoreboard
size D
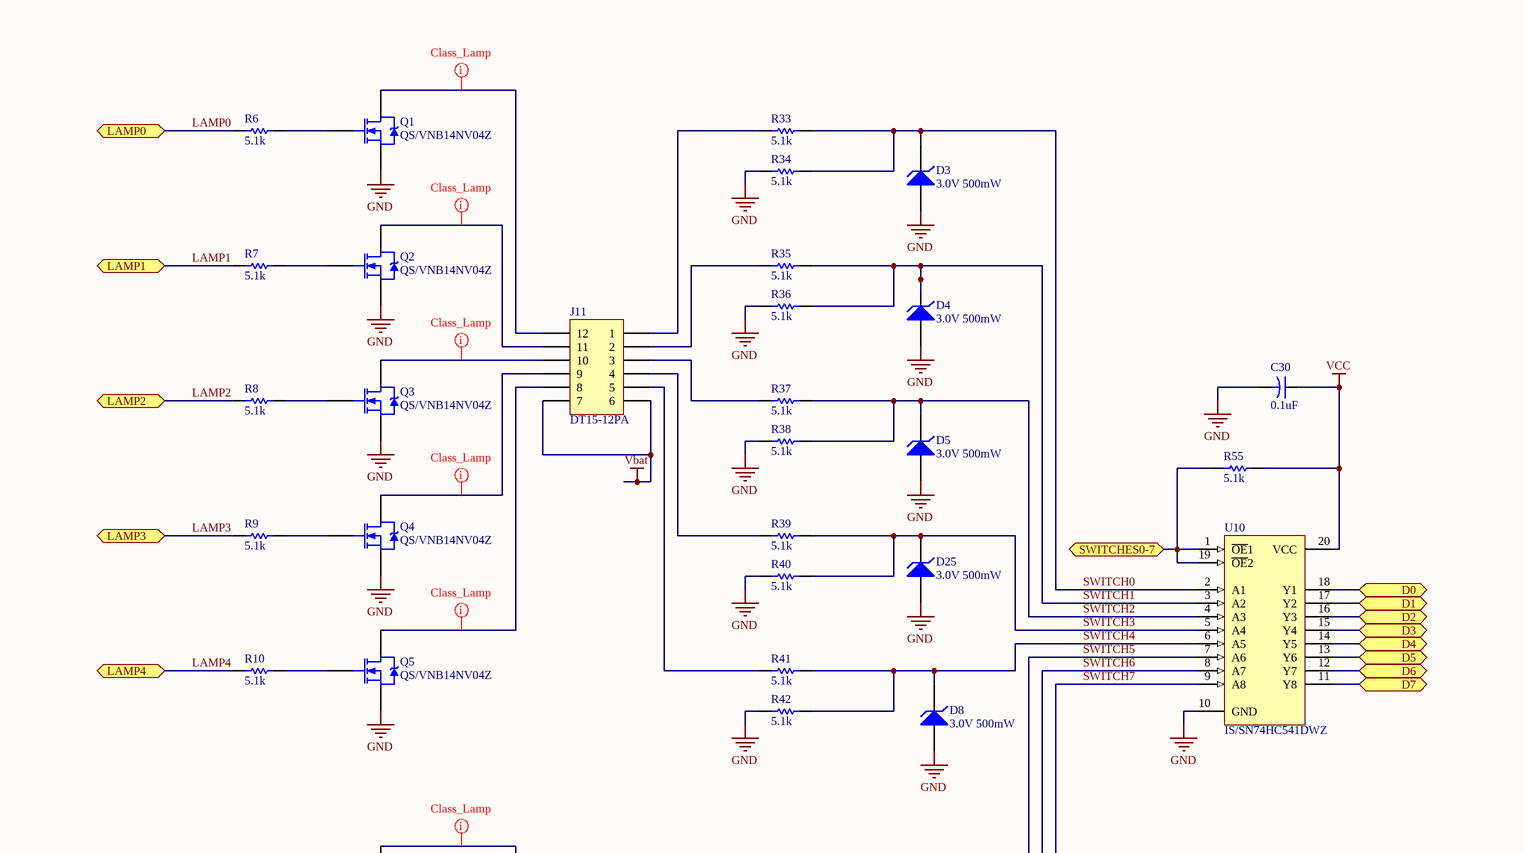
[diagram p9: ELC0102 - Switch Interface.SchDoc, top left]
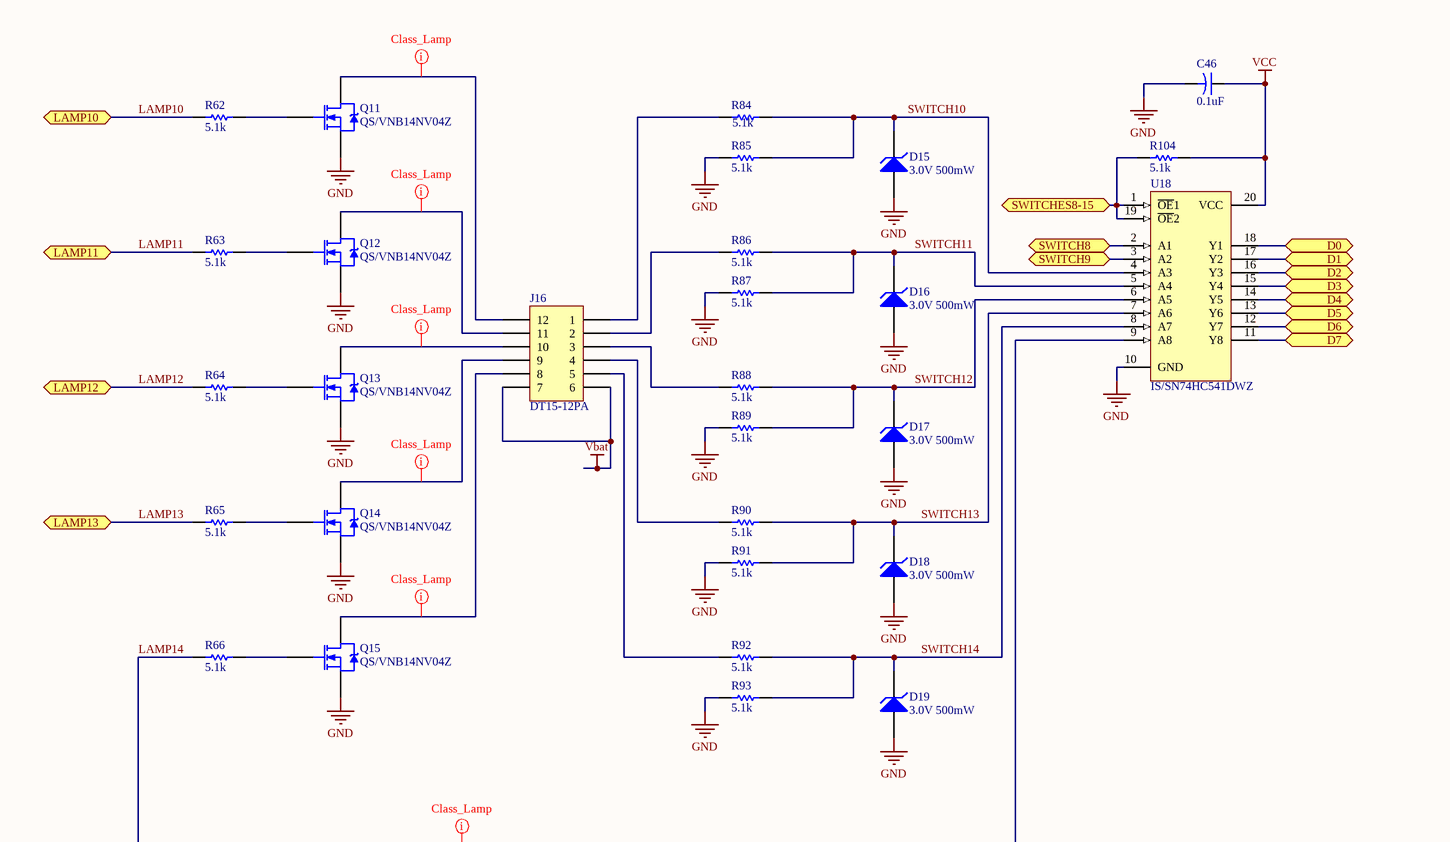
[diagram p10: ELC0102 - Switch Interface.SchDoc, top right]
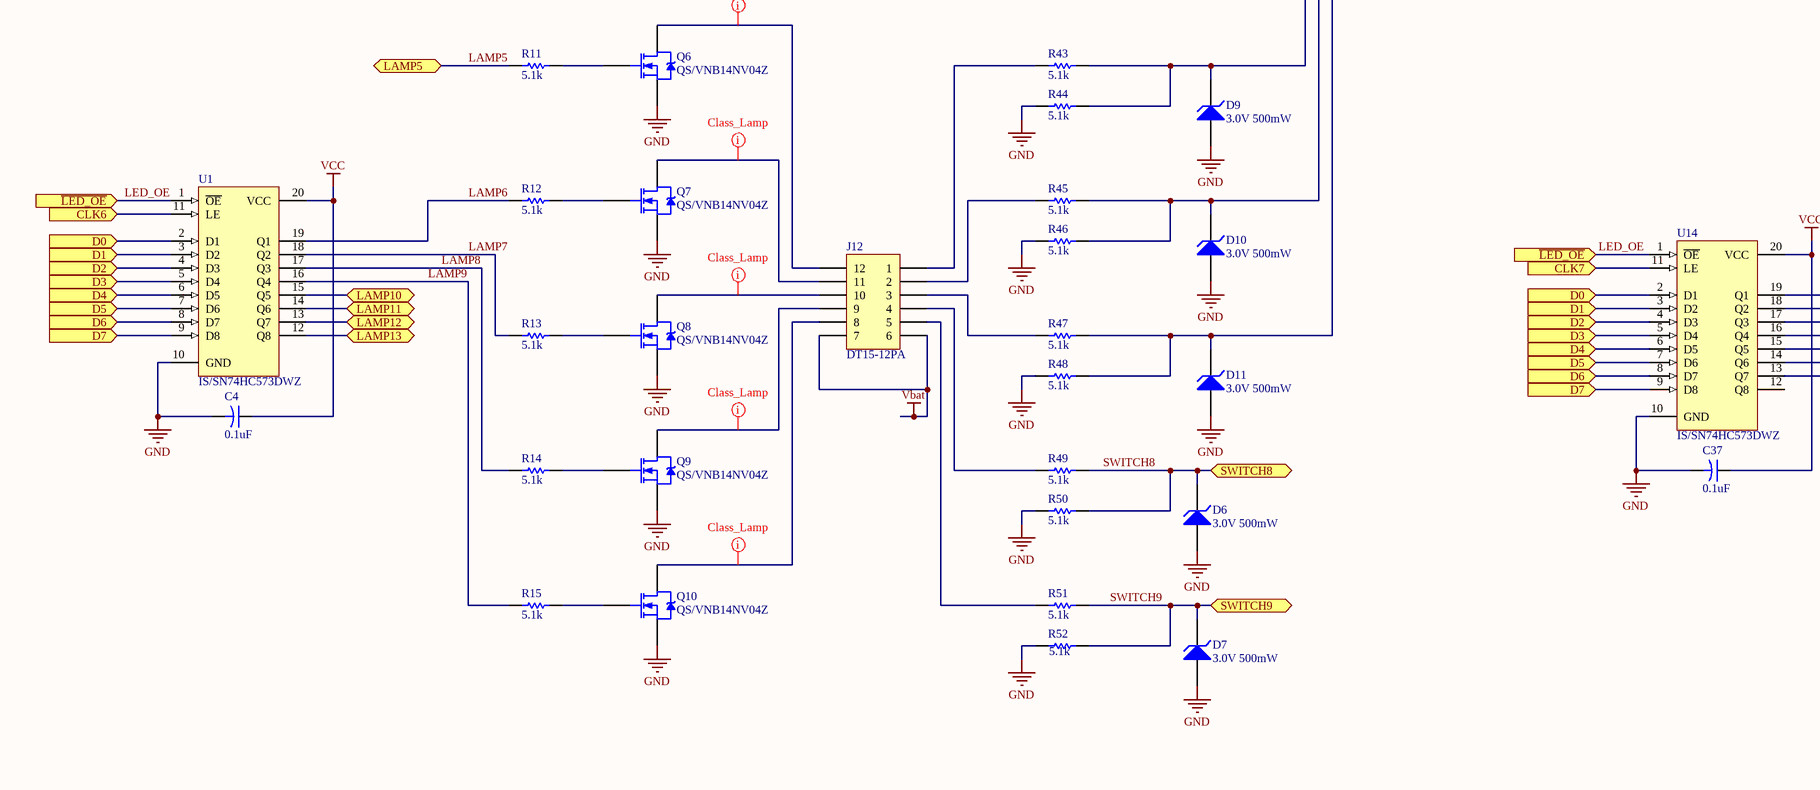
[diagram p11: ELC0102 - Switch Interface.SchDoc, bottom left]
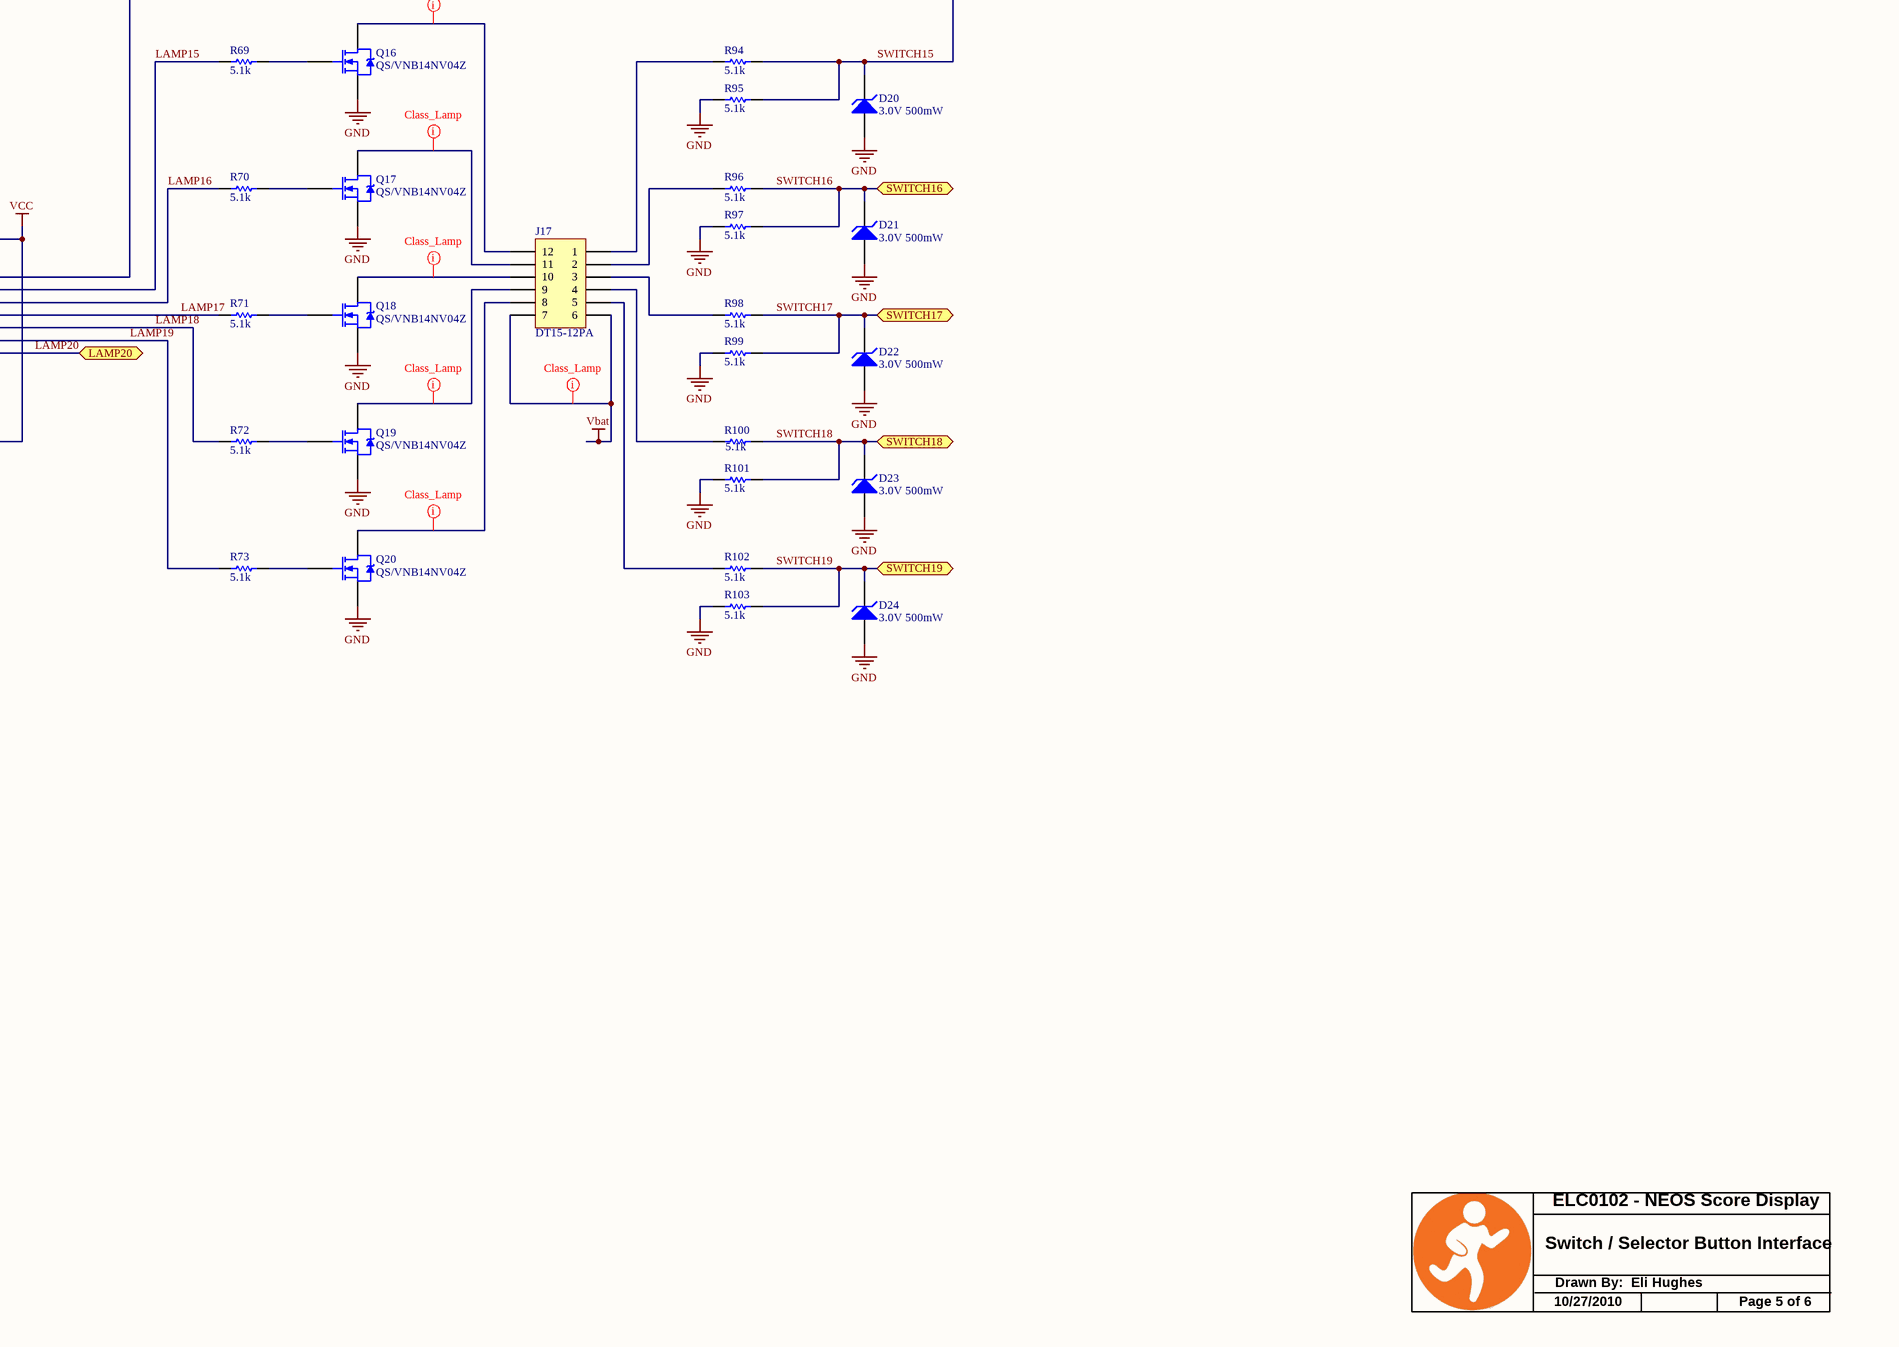
[diagram p12: ELC0102 - Switch Interface.SchDoc, bottom right]

### Parts
C4  0.1uF  [C0805]
C30  0.1uF  [C0805]
C37  0.1uF  [C0805]
C46  0.1uF  [C0805]
D3  3.0V 500mW  [SOD123]
D4  3.0V 500mW  [SOD123]
D5  3.0V 500mW  [SOD123]
D6  3.0V 500mW  [SOD123]
D7  3.0V 500mW  [SOD123]
D8  3.0V 500mW  [SOD123]
D9  3.0V 500mW  [SOD123]
D10  3.0V 500mW  [SOD123]
D11  3.0V 500mW  [SOD123]
D15  3.0V 500mW  [SOD123]
D16  3.0V 500mW  [SOD123]
D17  3.0V 500mW  [SOD123]
D18  3.0V 500mW  [SOD123]
D19  3.0V 500mW  [SOD123]
D20  3.0V 500mW  [SOD123]
D21  3.0V 500mW  [SOD123]
D22  3.0V 500mW  [SOD123]
D23  3.0V 500mW  [SOD123]
D24  3.0V 500mW  [SOD123]
D25  3.0V 500mW  [SOD123]
J11  DT15-12PA  [JDT1512PA00Z]
J12  DT15-12PA  [JDT1512PA00Z]
J16  DT15-12PA  [JDT1512PA00Z]
J17  DT15-12PA  [JDT1512PA00Z]
Q1  QS/VNB14NV04Z  [D2PAK]
Q2  QS/VNB14NV04Z  [D2PAK]
Q3  QS/VNB14NV04Z  [D2PAK]
Q4  QS/VNB14NV04Z  [D2PAK]
Q5  QS/VNB14NV04Z  [D2PAK]
Q6  QS/VNB14NV04Z  [D2PAK]
Q7  QS/VNB14NV04Z  [D2PAK]
Q8  QS/VNB14NV04Z  [D2PAK]
Q9  QS/VNB14NV04Z  [D2PAK]
Q10  QS/VNB14NV04Z  [D2PAK]
Q11  QS/VNB14NV04Z  [D2PAK]
Q12  QS/VNB14NV04Z  [D2PAK]
Q13  QS/VNB14NV04Z  [D2PAK]
Q14  QS/VNB14NV04Z  [D2PAK]
Q15  QS/VNB14NV04Z  [D2PAK]
Q16  QS/VNB14NV04Z  [D2PAK]
Q17  QS/VNB14NV04Z  [D2PAK]
Q18  QS/VNB14NV04Z  [D2PAK]
Q19  QS/VNB14NV04Z  [D2PAK]
Q20  QS/VNB14NV04Z  [D2PAK]
R6  5.1k  [R0805]
R7  5.1k  [R0805]
R8  5.1k  [R0805]
R9  5.1k  [R0805]
R10  5.1k  [R0805]
R11  5.1k  [R0805]
R12  5.1k  [R0805]
R13  5.1k  [R0805]
R14  5.1k  [R0805]
R15  5.1k  [R0805]
R33  5.1k  [R0805]
R34  5.1k  [R0805]
R35  5.1k  [R0805]
R36  5.1k  [R0805]
R37  5.1k  [R0805]
R38  5.1k  [R0805]
R39  5.1k  [R0805]
R40  5.1k  [R0805]
R41  5.1k  [R0805]
R42  5.1k  [R0805]
R43  5.1k  [R0805]
R44  5.1k  [R0805]
R45  5.1k  [R0805]
R46  5.1k  [R0805]
R47  5.1k  [R0805]
R48  5.1k  [R0805]
R49  5.1k  [R0805]
R50  5.1k  [R0805]
R51  5.1k  [R0805]
R52  5.1k  [R0805]
R55  5.1k  [R0805]
R62  5.1k  [R0805]
R63  5.1k  [R0805]
R64  5.1k  [R0805]
R65  5.1k  [R0805]
R66  5.1k  [R0805]
R69  5.1k  [R0805]
R70  5.1k  [R0805]
R71  5.1k  [R0805]
R72  5.1k  [R0805]
R73  5.1k  [R0805]
R84  5.1k  [R0805]
R85  5.1k  [R0805]
R86  5.1k  [R0805]
R87  5.1k  [R0805]
R88  5.1k  [R0805]
R89  5.1k  [R0805]
R90  5.1k  [R0805]
R91  5.1k  [R0805]
R92  5.1k  [R0805]
R93  5.1k  [R0805]
R94  5.1k  [R0805]
R95  5.1k  [R0805]
R96  5.1k  [R0805]
R97  5.1k  [R0805]
R98  5.1k  [R0805]
R99  5.1k  [R0805]
R100  5.1k  [R0805]
R101  5.1k  [R0805]
R102  5.1k  [R0805]
R103  5.1k  [R0805]
R104  5.1k  [R0805]
U1  IS/SN74HC573DWZ  [SOIC300-20]
U10  IS/SN74HC541DWZ  [SOIC300-20]
U14  IS/SN74HC573DWZ  [SOIC300-20]
U18  IS/SN74HC541DWZ  [SOIC300-20]

### Ports
CLK6 (in), CLK7 (in), D0, D0 (in), D1, D1 (in), D2, D2 (in), D3, D3 (in), D4, D4 (in), D5, D5 (in), D6, D6 (in), D7, D7 (in), LAMP0, LAMP1, LAMP2, LAMP3, LAMP4, LAMP5, LAMP10, LAMP11, LAMP12, LAMP13, LAMP20, SWITCH8, SWITCH9, SWITCH16, SWITCH17, SWITCH18, SWITCH19, SWITCHES0-7, SWITCHES8-15, ~{LED_OE} (in)

### Nets
GND: C4.2 C30.2 C37.2 C46.2 D3.1(A) D4.1(A) D5.1(A) D6.1(A) D7.1(A) D8.1(A) D9.1(A) D10.1(A) D11.1(A) D15.1(A) D16.1(A) D17.1(A) D18.1(A) D19.1(A) D20.1(A) D21.1(A) D22.1(A) D23.1(A) D24.1(A) D25.1(A) Q1.3(S) Q2.3(S) Q3.3(S) Q4.3(S) Q5.3(S) Q6.3(S) Q7.3(S) Q8.3(S) Q9.3(S) Q10.3(S) Q11.3(S) Q12.3(S) Q13.3(S) Q14.3(S) Q15.3(S) Q16.3(S) Q17.3(S) Q18.3(S) Q19.3(S) Q20.3(S) R34.2 R36.2 R38.2 R40.2 R42.2 R44.2 R46.2 R48.2 R50.2 R52.2 R85.2 R87.2 R89.2 R91.2 R93.2 R95.2 R97.2 R99.2 R101.2 R103.2 U1.10(GND) U10.10(GND) U14.10(GND) U18.10(GND)
Vbat: J11.6 J11.7 J12.6 J12.7 J16.6 J16.7 J17.6 J17.7
VCC: C4.1 C30.1 C37.1 C46.1 R55.1 R104.1 U1.20(VCC) U10.20(VCC) U14.20(VCC) U18.20(VCC)  [project net +3.3 VDC]
CLK6: U1.11(LE) ; port CLK6
CLK7: U14.11(LE) ; port CLK7
D0: U1.2(D1) U10.18(Y1) U14.2(D1) U18.18(Y1) ; port D0
D1: U1.3(D2) U10.17(Y2) U14.3(D2) U18.17(Y2) ; port D1
D2: U1.4(D3) U10.16(Y3) U14.4(D3) U18.16(Y3) ; port D2
D3: U1.5(D4) U10.15(Y4) U14.5(D4) U18.15(Y4) ; port D3
D4: U1.6(D5) U10.14(Y5) U14.6(D5) U18.14(Y5) ; port D4
D5: U1.7(D6) U10.13(Y6) U14.7(D6) U18.13(Y6) ; port D5
D6: U1.8(D7) U10.12(Y7) U14.8(D7) U18.12(Y7) ; port D6
D7: U1.9(D8) U10.11(Y8) U14.9(D8) U18.11(Y8) ; port D7
LAMP0: R6.1 ; port LAMP0
LAMP1: R7.1 ; port LAMP1
LAMP2: R8.1 ; port LAMP2
LAMP3: R9.1 ; port LAMP3
LAMP4: R10.1 ; port LAMP4
LAMP5: R11.1 ; port LAMP5
LAMP6: R12.1 U1.19(Q1)
LAMP7: R13.1 U1.18(Q2)
LAMP8: R14.1 U1.17(Q3)
LAMP9: R15.1 U1.16(Q4)
LAMP10: R62.1 U1.15(Q5) ; port LAMP10
LAMP11: R63.1 U1.14(Q6) ; port LAMP11
LAMP12: R64.1 U1.13(Q7) ; port LAMP12
LAMP13: R65.1 U1.12(Q8) ; port LAMP13
LAMP14: R66.1 U14.19(Q1)
LAMP15: R69.1 U14.18(Q2)
LAMP16: R70.1 U14.17(Q3)
LAMP17: R71.1 U14.16(Q4)
LAMP18: R72.1 U14.15(Q5)
LAMP19: R73.1 U14.14(Q6)
LAMP20: U14.13(Q7) ; port LAMP20
LED_OE: U1.1(~{OE}) U14.1(~{OE}) ; port ~{LED_OE}
SWITCH0: D3.2(K) R33.1 R34.1 U10.2(A1)
SWITCH1: D4.2(K) R35.1 R36.1 U10.3(A2)
SWITCH2: D5.2(K) R37.1 R38.1 U10.4(A3)
SWITCH3: D25.2(K) R39.1 R40.1 U10.5(A4)
SWITCH4: D8.2(K) R41.1 R42.1 U10.6(A5)
SWITCH5: D9.2(K) R43.1 R44.1 U10.7(A6)
SWITCH6: D10.2(K) R45.1 R46.1 U10.8(A7)
SWITCH7: D11.2(K) R47.1 R48.1 U10.9(A8)
SWITCH8: D6.2(K) R49.1 R50.1 U18.2(A1) ; port SWITCH8
SWITCH9: D7.2(K) R51.1 R52.1 U18.3(A2) ; port SWITCH9
SWITCH10: D15.2(K) R84.1 R85.1 U18.4(A3)
SWITCH11: D16.2(K) R86.1 R87.1 U18.5(A4)
SWITCH12: D17.2(K) R88.1 R89.1 U18.6(A5)
SWITCH13: D18.2(K) R90.1 R91.1 U18.7(A6)
SWITCH14: D19.2(K) R92.1 R93.1 U18.8(A7)
SWITCH15: D20.2(K) R94.1 R95.1 U18.9(A8)
SWITCH16: D21.2(K) R96.1 R97.1 ; port SWITCH16
SWITCH17: D22.2(K) R98.1 R99.1 ; port SWITCH17
SWITCH18: D23.2(K) R100.1 R101.1 ; port SWITCH18
SWITCH19: D24.2(K) R102.1 R103.1 ; port SWITCH19
SWITCHES0-7: R55.2 U10.1(~{OE}1) U10.19(~{OE}2) ; port SWITCHES0-7
SWITCHES8-15: R104.2 U18.1(~{OE}1) U18.19(~{OE}2) ; port SWITCHES8-15
NetJ11_1: J11.1 R33.2
NetJ11_2: J11.2 R35.2
NetJ11_3: J11.3 R37.2
NetJ11_4: J11.4 R39.2
NetJ11_5: J11.5 R41.2
NetJ11_8: J11.8 Q5.2(D)
NetJ11_9: J11.9 Q4.2(D)
NetJ11_10: J11.10 Q3.2(D)
NetJ11_11: J11.11 Q2.2(D)
NetJ11_12: J11.12 Q1.2(D)
NetJ12_1: J12.1 R43.2
NetJ12_2: J12.2 R45.2
NetJ12_3: J12.3 R47.2
NetJ12_4: J12.4 R49.2
NetJ12_5: J12.5 R51.2
NetJ12_8: J12.8 Q10.2(D)
NetJ12_9: J12.9 Q9.2(D)
NetJ12_10: J12.10 Q8.2(D)
NetJ12_11: J12.11 Q7.2(D)
NetJ12_12: J12.12 Q6.2(D)
NetJ16_1: J16.1 R84.2
NetJ16_2: J16.2 R86.2
NetJ16_3: J16.3 R88.2
NetJ16_4: J16.4 R90.2
NetJ16_5: J16.5 R92.2
NetJ16_8: J16.8 Q15.2(D)
NetJ16_9: J16.9 Q14.2(D)
NetJ16_10: J16.10 Q13.2(D)
NetJ16_11: J16.11 Q12.2(D)
NetJ16_12: J16.12 Q11.2(D)
NetJ17_1: J17.1 R94.2
NetJ17_2: J17.2 R96.2
NetJ17_3: J17.3 R98.2
NetJ17_4: J17.4 R100.2
NetJ17_5: J17.5 R102.2
NetJ17_8: J17.8 Q20.2(D)
NetJ17_9: J17.9 Q19.2(D)
NetJ17_10: J17.10 Q18.2(D)
NetJ17_11: J17.11 Q17.2(D)
NetJ17_12: J17.12 Q16.2(D)
NetQ1_1: Q1.1(G) R6.2
NetQ2_1: Q2.1(G) R7.2
NetQ3_1: Q3.1(G) R8.2
NetQ4_1: Q4.1(G) R9.2
NetQ5_1: Q5.1(G) R10.2
NetQ6_1: Q6.1(G) R11.2
NetQ7_1: Q7.1(G) R12.2
NetQ8_1: Q8.1(G) R13.2
NetQ9_1: Q9.1(G) R14.2
NetQ10_1: Q10.1(G) R15.2
NetQ11_1: Q11.1(G) R62.2
NetQ12_1: Q12.1(G) R63.2
NetQ13_1: Q13.1(G) R64.2
NetQ14_1: Q14.1(G) R65.2
NetQ15_1: Q15.1(G) R66.2
NetQ16_1: Q16.1(G) R69.2
NetQ17_1: Q17.1(G) R70.2
NetQ18_1: Q18.1(G) R71.2
NetQ19_1: Q19.1(G) R72.2
NetQ20_1: Q20.1(G) R73.2

Not connected (* = marked no-connect by the designer): U14 12(Q8)

### Layout directives
net class Class_Lamp: NetJ11_8, NetJ11_9, NetJ11_10, NetJ11_11, NetJ11_12, NetJ12_8, NetJ12_9, NetJ12_10, NetJ12_11, NetJ12_12, NetJ16_8, NetJ16_9, NetJ16_10, NetJ16_11, NetJ16_12, NetJ17_8, NetJ17_9, NetJ17_10, NetJ17_11, NetJ17_12, Vbat

### Notes on the sheet
- Switch / Selector Button Interface
- ELC0102 - NEOS Score Display
- 10/27/2010
- Drawn By:  Eli Hughes
- Page 5 of 6

### Library data of the parts
C4 C30 C37 C46 = CS/C0805C104K5RACK: as C1 on sheet ELC0102 - ScoreBoard - TopLevel; ROHS Certificate: Lead free / RoHS compliant; Source: Digikey; Value: 0.1uF; Supplier 1: Digi-Key; RoHS: RoHS Compliant; Category: Capacitors; Stock 1: 10120790; Pricing 1: 10=0.105, 100=0.0378, 250=0.02732, 500=0.02016, 1000=0.01365 (USD); Voltage - Rated: 50V; Temperature Coefficient: X7R; Mounting Type: Surface Mount, MLCC; Operating Temperature: -55°C ~ 125°C; Features: -; Applications: General Purpose; Ratings: -; Package / Case: 0805 (2012 Metric); Size / Dimension: 0.079" L x 0.049" W (2.00mm x 1.25mm); Lead Spacing: -; Thickness: 0.90mm; Packaging: Cut Tape (CT); Lead Style: -; ComponentLink1URL: http://www.kemet.com/datasheets&C0805C104K5RACTU; ComponentLink1Description: http://www.kemet.com/datasheets&C0805C104K5RACTU; Supplier Part Number 1: 399-1170-1-ND
D3-D11 D15-D25 = DS/MMSZ5225BT1Z: Zener 3.0V SOD-123; Manufacturer: ON Semiconductor; Manufacturer Part Number: MMSZ5225BT1G; Source Part Number: MMSZ5225BT1GOSCT-ND; Value: MMSZ5225BT1G; Description: DIODE ZENER 3V 500MW SOD-123; Voltage - Zener (Nom) (Vz): 3V; Voltage - Forward (Vf) (Max) @ If: 900mV @ 10mA; Current - Reverse Leakage @ Vr: 50µA @ 1V; Tolerance: ±5%; Impedance (Max) (Zzt): 29 Ohm; ROHS Certificate: Lead free / RoHS compliant; Source: Digikey; Supplier 1: Digi-Key; RoHS: RoHS Compliant; Category: Discrete Semiconductor Products; Stock 1: 27337; Pricing 1: 1=0.52, 10=0.356, 100=0.1676, 250=0.1194, 500=0.09114, 1000=0.06285 (USD); Power - Max: 500mW; Mounting Type: Surface Mount; Package / Case: SOD-123; Packaging: Cut Tape (CT); Operating Temperature: -55°C ~ 150°C; Supplier Device Package: SOD-123; ComponentLink1URL: http://www.onsemi.com/pub_link/Collateral/MMSZ5221BT1-D.PDF; ComponentLink1Description: http://www.onsemi.com/pub_link/Collateral/MMSZ5221BT1-D.PDF; Supplier Part Number 1: MMSZ5225BT1GOSCT-ND
J11 J12 J16 J17 = JDT1512PA00Z: Deutsch 12P Sealed PCB connector; Manufacturer: Deutsch; Manufacturer Part Number: DT15-12PA; ROHS Certificate: ROHS Compliant; Value: DT15-12PA; Supplier 1: LADD Industries Inc.; Supplier Part Number 1: DT15-12PA
Q1-Q20 = QS/VNB14NV04Z: HEXFET Power MOSFET; Manufacturer: STMicroelectronics; Source Part Number: VNB14NV04-ND; Description: MOSFET POWER 40V 12A D2PAK; Type: Low Side; Input Type: Non-Inverting; Number of Outputs: 1; On-State Resistance: 35 mOhm; Current - Peak Output: 18A; Manufacturer Part Number: VNB14NV04; ROHS Certificate: Lead free / RoHS compliant; Source: Digikey; Value: VNB14NV04; Supplier 1: Digi-Key; RoHS: RoHS Compliant; Category: Integrated Circuits (ICs); Stock 1: 0; Pricing 1: 800=1.5495 (USD); Current - Output / Channel: -; Voltage - Supply: -; Operating Temperature: -; Mounting Type: Surface Mount; Package / Case: TO-263-2, D²Pak (2 leads + Tab), TO-263AB; Packaging: Tube; Supplier Device Package: *; ComponentLink1URL: http://www.st.com/stonline/products/literature/ds/1643/vnb14n04.pdf; ComponentLink1Description: http://www.st.com/stonline/products/literature/ds/1643/vnb14n04.pdf; Supplier Part Number 1: VNB14NV04-ND
R6-R15 R33-R52 R55 R62-R66 R69-R73 R84-R104 = ERJ-6ENF5101V: as R3 on sheet ELC0102 - ScoreBoard - TopLevel; ComponentLink1Description: http://industrial.panasonic.com/www-cgi/jvcr13pz.cgi?E+PZ+3+AOA0002+ERJ6ENF5101V+7+WW; ComponentLink1URL: http://industrial.panasonic.com/www-cgi/jvcr13pz.cgi?E+PZ+3+AOA0002+ERJ6ENF5101V+7+WW; Value: 5.1k; Supplier 1: Digi-Key; Manufacturer Part Number: ERJ-6ENF5101V; RoHS: RoHS Compliant; Category: Resistors; Stock 1: 32293; Pricing 1: 1=0.07, 50=0.0276, 100=0.021, 250=0.0156, 500=0.01152, 1000=0.00768 (USD); Resistance In Ohms: 5.10K; Composition: Thick Film; Features: -; Tolerance: ±1%; Case: 0805 (2012 metric); Size / Dimension: 0.079" L x 0.049" W (2.00mm x 1.25mm); Height: 0.024" (0.60mm); Lead Style: Surface Mount (SMD - SMT); Packaging: Digi-Reel®; Supplier Part Number 1: P5.10KCDKR-ND
U1 U14 = IS/SN74HC573DWZ: Octal D-Type Transparent Latch with 3-State Outputs; Manufacturer: NXP Semiconductors; Manufacturer Part Number: 74HC573D-T; Source Part Number: 568-1477-2-ND; Value: 74HC573D-T; Description: IC LATCH OCTAL D 3STATE 20SOIC; Circuit: 8:8; Output Type: Tri-State; Voltage - Supply: 2 V ~ 6 V; Independent Circuits: 1; Delay Time - Propagation: 14ns; Current - Output High, Low: 7.8mA, 7.8mA; ROHS Certificate: Lead free / RoHS compliant; Source: Digikey; Supplier 1: Digi-Key; RoHS: RoHS Compliant; Category: Integrated Circuits (ICs); Stock 1: 46803; Pricing 1: 1=0.84, 25=0.646, 100=0.57, 250=0.494, 500=0.418 (USD); Logic Type: D-Type Transparent Latch; Operating Temperature: -40°C ~ 125°C; Mounting Type: Surface Mount; Package / Case: 20-SOIC (0.300", 7.50mm Width); Packaging: Cut Tape (CT); Supplier Device Package: 20-SOIC; ComponentLink1URL: http://www.nxp.com/documents/data_sheet/74HC_HCT573.pdf; ComponentLink1Description: http://www.nxp.com/documents/data_sheet/74HC_HCT573.pdf; Supplier Part Number 1: 568-1477-1-ND
U10 U18 = IS/SN74HC541DWZ: Octal Buffer and Line Driver with 3-State Outputs; Manufacturer: Texas Instruments; Manufacturer Part Number: SN74HC541DWR; Source Part Number: 296-1202-2-ND; Value: SN74HC541DWR; Description: IC BUFF/DVR TRI-ST 8BIT 20SOIC; Logic Type: Buffer/Line Driver, Non-Inverting; Number of Elements: 1; Number of Bits per Element: 8; Current - Output High, Low: 7.8mA, 7.8mA; Voltage - Supply: 2 V ~ 6 V; ROHS Certificate: Lead free / RoHS compliant; Source: Digikey; Supplier 1: Digi-Key; RoHS: RoHS Compliant; Category: Integrated Circuits (ICs); Stock 1: 8100; Pricing 1: 1=0.72, 25=0.5004, 100=0.429, 250=0.37052, 500=0.3185, 1000=0.247 (USD); Operating Temperature: -40°C ~ 85°C; Mounting Type: Surface Mount; Package / Case: 20-SOIC (0.300", 7.50mm Width); Packaging: Cut Tape (CT); Supplier Device Package: *; ComponentLink1URL: http://focus.ti.com/lit/ds/symlink/sn74hc541.pdf; ComponentLink1Description: http://focus.ti.com/lit/ds/symlink/sn74hc541.pdf; Supplier Part Number 1: 296-1202-1-ND

## Nets that join several sheets
+3.3 VDC: ELC0102 - Green Digits (6 pins), ELC0102 - Red Digits (6 pins), ELC0102 - ScoreBoard - TopLevel (20 pins), ELC0102 - Switch Interface (10 pins)
GND: ELC0102 - Green Digits (27 pins), ELC0102 - Red Digits (27 pins), ELC0102 - ScoreBoard - TopLevel (37 pins), ELC0102 - Switch Interface (68 pins)
Vbat: ELC0102 - ScoreBoard - TopLevel (D1.A J2.1 J6.1), ELC0102 - Switch Interface (8 pins)
8V: ELC0102 - Green Digits (42 pins), ELC0102 - Red Digits (42 pins), ELC0102 - ScoreBoard - TopLevel (6 pins)
CLK0: ELC0102 - Red Digits (U19.11), ELC0102 - ScoreBoard - TopLevel (U25.15)
CLK1: ELC0102 - Red Digits (U20.11), ELC0102 - ScoreBoard - TopLevel (U25.14)
CLK2: ELC0102 - Red Digits (U21.11), ELC0102 - ScoreBoard - TopLevel (U25.13)
CLK3: ELC0102 - Green Digits (U22.11), ELC0102 - ScoreBoard - TopLevel (U25.12)
CLK4: ELC0102 - Green Digits (U23.11), ELC0102 - ScoreBoard - TopLevel (U25.11)
CLK5: ELC0102 - Green Digits (U24.11), ELC0102 - ScoreBoard - TopLevel (U25.10)
CLK6: ELC0102 - ScoreBoard - TopLevel (U25.9), ELC0102 - Switch Interface (U1.11)
CLK7: ELC0102 - ScoreBoard - TopLevel (U25.7), ELC0102 - Switch Interface (U14.11)
D0: ELC0102 - Green Digits (U22.2 U23.2 U24.2), ELC0102 - Red Digits (U19.2 U20.2 U21.2), ELC0102 - ScoreBoard - TopLevel (U3.58), ELC0102 - Switch Interface (U1.2 U10.18 U14.2 U18.18)
D1: ELC0102 - Green Digits (U22.3 U23.3 U24.3), ELC0102 - Red Digits (U19.3 U20.3 U21.3), ELC0102 - ScoreBoard - TopLevel (U3.61), ELC0102 - Switch Interface (U1.3 U10.17 U14.3 U18.17)
D2: ELC0102 - Green Digits (U22.4 U23.4 U24.4), ELC0102 - Red Digits (U19.4 U20.4 U21.4), ELC0102 - ScoreBoard - TopLevel (U3.62), ELC0102 - Switch Interface (U1.4 U10.16 U14.4 U18.16)
D3: ELC0102 - Green Digits (U22.5 U23.5 U24.5), ELC0102 - Red Digits (U19.5 U20.5 U21.5), ELC0102 - ScoreBoard - TopLevel (U3.63), ELC0102 - Switch Interface (U1.5 U10.15 U14.5 U18.15)
D4: ELC0102 - Green Digits (U22.6 U23.6 U24.6), ELC0102 - Red Digits (U19.6 U20.6 U21.6), ELC0102 - ScoreBoard - TopLevel (U3.66), ELC0102 - Switch Interface (U1.6 U10.14 U14.6 U18.14)
D5: ELC0102 - Green Digits (U22.7 U23.7 U24.7), ELC0102 - Red Digits (U19.7 U20.7 U21.7), ELC0102 - ScoreBoard - TopLevel (U3.67), ELC0102 - Switch Interface (U1.7 U10.13 U14.7 U18.13)
D6: ELC0102 - Green Digits (U22.8 U23.8 U24.8), ELC0102 - Red Digits (U19.8 U20.8 U21.8), ELC0102 - ScoreBoard - TopLevel (U3.68), ELC0102 - Switch Interface (U1.8 U10.12 U14.8 U18.12)
D7: ELC0102 - Green Digits (U22.9 U23.9 U24.9), ELC0102 - Red Digits (U19.9 U20.9 U21.9), ELC0102 - ScoreBoard - TopLevel (U3.69), ELC0102 - Switch Interface (U1.9 U10.11 U14.9 U18.11)
LAMP0: ELC0102 - Red Digits (U19.12), ELC0102 - Switch Interface (R6.1)
LAMP1: ELC0102 - Red Digits (U20.12), ELC0102 - Switch Interface (R7.1)
LAMP2: ELC0102 - Red Digits (U21.12), ELC0102 - Switch Interface (R8.1)
LAMP3: ELC0102 - Green Digits (U22.12), ELC0102 - Switch Interface (R9.1)
LAMP4: ELC0102 - Green Digits (U23.12), ELC0102 - Switch Interface (R10.1)
LAMP5: ELC0102 - Green Digits (U24.12), ELC0102 - Switch Interface (R11.1)
LED_OE: ELC0102 - Green Digits (U22.1 U23.1 U24.1), ELC0102 - Red Digits (U19.1 U20.1 U21.1), ELC0102 - ScoreBoard - TopLevel (R19.2 U3.38), ELC0102 - Switch Interface (U1.1 U14.1)
SWITCH16: ELC0102 - ScoreBoard - TopLevel (U3.2), ELC0102 - Switch Interface (D21.2 R96.1 R97.1)
SWITCH17: ELC0102 - ScoreBoard - TopLevel (U3.3), ELC0102 - Switch Interface (D22.2 R98.1 R99.1)
SWITCH18: ELC0102 - ScoreBoard - TopLevel (U3.59), ELC0102 - Switch Interface (D23.2 R100.1 R101.1)
SWITCH19: ELC0102 - ScoreBoard - TopLevel (U3.60), ELC0102 - Switch Interface (D24.2 R102.1 R103.1)
SWITCHES0-7: ELC0102 - ScoreBoard - TopLevel (U3.74), ELC0102 - Switch Interface (R55.2 U10.1 U10.19)
SWITCHES8-15: ELC0102 - ScoreBoard - TopLevel (U3.47), ELC0102 - Switch Interface (R104.2 U18.1 U18.19)

## Assembly variants
MAIN_BUILD: not fitted C5 C6 C7 C12 C13 C14 C16 C18 C19 C21 C25 C27 C29 C33 C34 C35 C36 C38 C39 C40 C41 C42 C43 C44 C45 C54 D12 D13 D14 J14 J15 J18 J19 JP1 JP2 JP3 JP4 Q21 R1 R2 R4 R5 R16 R20 R21 R22 R23 R24 R25 R26 R27 R28 R30 R31 R53 R54 R58 R59 R60 R61 R67 R68 R74 R75 R76 R77 R78 R79 R80 R81 R82 R83 R232 R233 R234 U2 U4 U6 U9 U11 U13 U15 U16 U17 U26 Y2